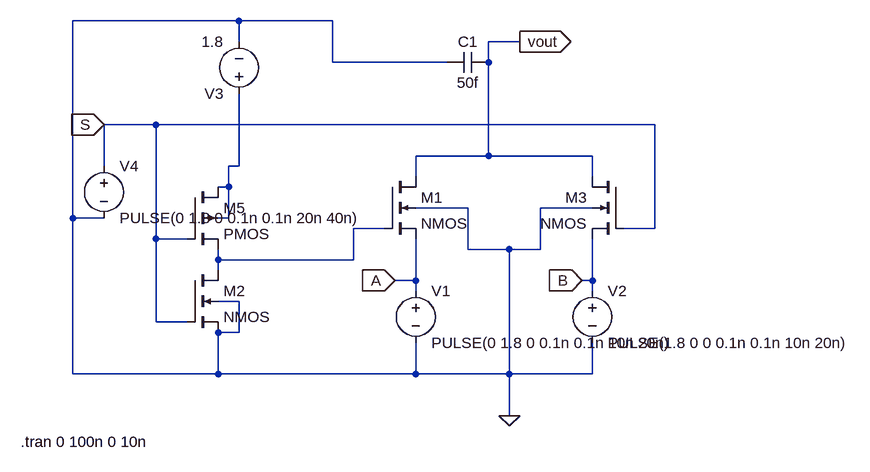
[diagram p0: schematic 2x1mux.asc]
2x1mux.asc, the LTspice schematic file:
Version 4
SHEET 1 1064 680
WIRE -208 -160 -464 -160
WIRE -64 -160 -208 -160
WIRE -208 -128 -208 -160
WIRE 224 -128 176 -128
WIRE -64 -96 -64 -160
WIRE 112 -96 -64 -96
WIRE 176 -96 176 -128
WIRE -336 0 -416 0
WIRE 432 0 -336 0
WIRE 176 48 176 -96
WIRE 176 48 64 48
WIRE 336 48 176 48
WIRE -416 64 -416 0
WIRE -208 64 -208 -48
WIRE -208 64 -224 64
WIRE 64 80 64 48
WIRE 336 80 336 48
WIRE -224 96 -224 64
WIRE -224 96 -240 96
WIRE 144 128 64 128
WIRE 336 128 256 128
WIRE -464 144 -464 -160
WIRE -416 144 -464 144
WIRE -224 144 -224 96
WIRE -224 144 -240 144
WIRE 16 160 -32 160
WIRE 432 160 432 0
WIRE 432 160 384 160
WIRE -336 176 -336 0
WIRE -288 176 -336 176
WIRE 144 192 144 128
WIRE 208 192 144 192
WIRE 256 192 256 128
WIRE 256 192 208 192
WIRE -240 208 -240 192
WIRE -32 208 -32 160
WIRE -32 208 -240 208
WIRE -240 224 -240 208
WIRE 64 240 64 176
WIRE 64 240 32 240
WIRE 336 240 336 176
WIRE 336 240 320 240
WIRE 64 256 64 240
WIRE 336 256 336 240
WIRE -208 272 -240 272
WIRE -336 304 -336 176
WIRE -288 304 -336 304
WIRE -208 320 -208 272
WIRE -208 320 -240 320
WIRE -464 384 -464 144
WIRE -240 384 -240 320
WIRE -240 384 -464 384
WIRE 64 384 64 336
WIRE 64 384 -240 384
WIRE 208 384 208 192
WIRE 208 384 64 384
WIRE 336 384 336 336
WIRE 336 384 208 384
WIRE 208 448 208 384
FLAG 208 448 0
FLAG 224 -128 vout
IOPIN 224 -128 Out
FLAG 32 240 A
IOPIN 32 240 In
FLAG 320 240 B
IOPIN 320 240 In
FLAG -416 0 S
IOPIN -416 0 In
SYMBOL nmos4 16 80 R0
SYMATTR InstName M1
SYMATTR Value2 l=180n w=270n
SYMBOL voltage 64 240 R0
WINDOW 123 0 0 Left 0
WINDOW 39 0 0 Left 0
SYMATTR InstName V1
SYMATTR Value PULSE(0 1.8 0 0.1n 0.1n 10n 20n)
SYMBOL voltage 336 240 R0
WINDOW 123 0 0 Left 0
WINDOW 39 0 0 Left 0
SYMATTR InstName V2
SYMATTR Value PULSE(1.8 0 0 0.1n 0.1n 10n 20n)
SYMBOL nmos4 384 80 M0
SYMATTR InstName M3
SYMATTR Value2 l=180n w=270n
SYMBOL nmos4 -288 224 R0
SYMATTR InstName M2
SYMATTR Value2 l=180n w=270n
SYMBOL pmos4 -288 96 R0
SYMATTR InstName M5
SYMBOL voltage -208 -32 R180
WINDOW 123 0 0 Left 0
WINDOW 39 0 0 Left 0
SYMATTR InstName V3
SYMATTR Value 1.8
SYMBOL voltage -416 48 R0
WINDOW 123 0 0 Left 0
WINDOW 39 0 0 Left 0
SYMATTR InstName V4
SYMATTR Value PULSE(0 1.8 0 0.1n 0.1n 20n 40n)
SYMBOL cap 176 -112 R90
WINDOW 0 0 32 VBottom 2
WINDOW 3 32 32 VTop 2
SYMATTR InstName C1
SYMATTR Value 50f
TEXT -544 488 Left 2 !.tran 0 100n 0 10n

The netlist it stands for:
* 2x1mux.asc
M1 vout N002 A 0 NMOS l=180n w=270n
V1 A 0 PULSE(0 1.8 0 0.1n 0.1n 10n 20n)
V2 B 0 PULSE(1.8 0 0 0.1n 0.1n 10n 20n)
M3 vout S B 0 NMOS l=180n w=270n
M2 N002 S 0 0 NMOS l=180n w=270n
M5 N001 S N002 N001 PMOS
V3 N001 0 1.8
V4 S 0 PULSE(0 1.8 0 0.1n 0.1n 20n 40n)
C1 vout 0 50f
.model NMOS NMOS
.model PMOS PMOS
.lib standard.mos
.tran 0 100n 0 10n
.backanno
.end